# Altium schematic sheet sb-sonata-usbphy.SchDoc: USB Phy
size Letter; Organization: NewAE Technology Inc.; Address1: 1083 Queen St., Suite 196; Address2: Halifax; Address3: NS; Address4: Canada B3H 0B2; SheetNumber: 18; SheetTotal: 20; SheetApproved: NO
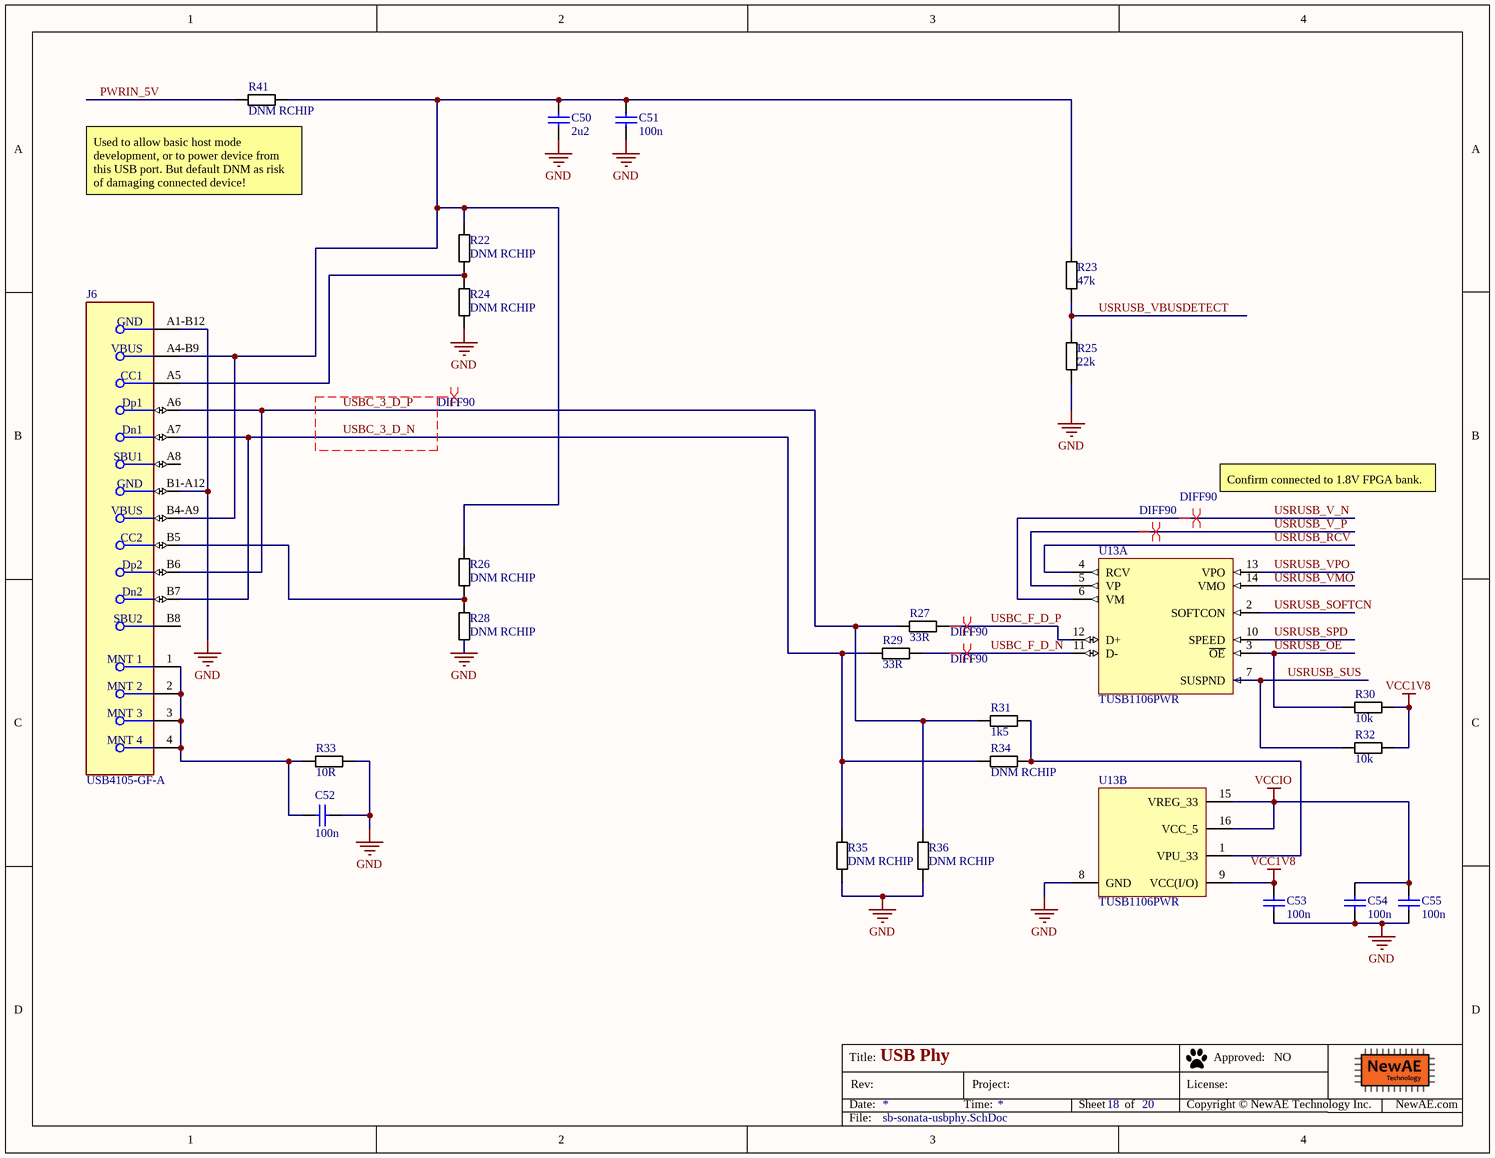
[diagram p0: sb-sonata-usbphy.SchDoc]

## Parts
C50  2u2  [CAPC0603_M]
C51  100n  [CAPC0402_M]
C52  100n  [CAPC0603_M]
C53  100n  [CAPC0402_M]
C54  100n  [CAPC0402_M]
C55  100n  [CAPC0402_M]
J6  USB4105-GF-A  [FP-USB4105-GF-A-MFG]
R22  DNM RCHIP  [RESC1608X55N]
R23  47k  [RESC1005X40N]
R24  DNM RCHIP  [RESC1608X55N]
R25  22k  [RESC1005X40N]
R26  DNM RCHIP  [RESC1608X55N]
R27  33R  [RESC1608X55N]
R28  DNM RCHIP  [RESC1608X55N]
R29  33R  [RESC1608X55N]
R30  10k  [RESC1005X40N]
R31  1k5  [RESC1608X55N]
R32  10k  [RESC1005X40N]
R33  10R  [RESC1608X55N]
R34  DNM RCHIP  [RESC1608X55N]
R35  DNM RCHIP  [RESC1608X55N]
R36  DNM RCHIP  [RESC1608X55N]
R41  DNM RCHIP  [RESC1608X55N]
U13  TUSB1106PWR  [PW0016A_L]  (parts A,B of 2)

## Nets
GND: C50.2 C51.2 C52.2 C53.2 C54.2 C55.2 J6.A1-B12(GND) J6.B1-A12(GND) R24.2 R25.2 R28.2 R33.2 R35.1 R36.1 U13.8(GND)
VCC1V8: C53.1 R30.2 R32.2 U13.9(VCC(I/O))
VCCIO: C54.1 C55.1 U13.15(VREG_33) U13.16(VCC_5)
PWRIN_5V: R41.2
USBC_3_D_N: J6.A7(Dn1) J6.B7(Dn2) R29.1 R34.1 R35.2
USBC_3_D_P: J6.A6(Dp1) J6.B6(Dp2) R27.1 R31.1 R36.2
USBC_F_D_N: R29.2 U13.11(D-)
USBC_F_D_P: R27.2 U13.12(D+)
USRUSB_OE: R30.1 U13.3(~{OE})
USRUSB_RCV: U13.4(RCV)
USRUSB_SOFTCN: U13.2(SOFTCON)
USRUSB_SPD: U13.10(SPEED)
USRUSB_SUS: R32.1 U13.7(SUSPND)
USRUSB_V_N: U13.6(VM)
USRUSB_V_P: U13.5(VP)
USRUSB_VBUSDETECT: R23.2 R25.1
USRUSB_VMO: U13.14(VMO)
USRUSB_VPO: U13.13(VPO)
NetC50_1: C50.1 C51.1 J6.A4-B9(VBUS) J6.B4-A9(VBUS) R22.1 R23.1 R26.1 R41.1
NetC52_1: C52.1 J6.1(MNT_1) J6.2(MNT_2) J6.3(MNT_3) J6.4(MNT_4) R33.1
NetJ6_A5: J6.A5(CC1) R22.2 R24.1
NetJ6_B5: J6.B5(CC2) R26.2 R28.1
NetR31_2: R31.2 R34.2 U13.1(VPU_33)

Not connected (* = marked no-connect by the designer): J6 A8(SBU1) B8(SBU2)

## Layout directives
differential pair; differential pair class DIFF90: USBC_3_D_N, USBC_3_D_P, USBC_F_D_N, USBC_F_D_P, USRUSB_V_N, USRUSB_V_P

## Notes on the sheet
- (near R41) Used to allow basic host mode development, or to power device from this USB port. But default DNM as risk of damaging connected device!
- Confirm connected to 1.8V FPGA bank.
- Title:
- Date:
- Rev:
- Time:
- Project:
- Sheet
- of
- License:
- Copyright © NewAE Technology Inc.
- Approved:
- NewAE.com
- File:

## Library data of the parts
C50 = CCHIP-2u2-0603: 2u2, 0603; Manufacture 1: Samsung; Manufacture Part Number 1: CL10B225KP8NNNC; Component Group: Capacitor; Case-EIA: 0603; Case-Metric: 1608; Rated Voltage: 10VDC; Part Number: CCHIP-2u2-0603; Footprint: 0603; Pin Count: 2; Supplier 1: Digi-Key; Supplier Part Number 1: 1276-1134-1-ND; Value: 2u2; Mounting Technology: SMT; Component Kind: Standard; Component Type: Standard
C51 C53-C55 = CCHIP-100n-0402: 100n, 0402; Manufacture Part Number 1: CGA2B3X7R1V104K050BB; Component Group: Capacitor; Case-EIA: 0402; Part Number: CCHIP-100n-0402; Footprint: 0402; Pin Count: 2; Value: 100n; Mounting Technology: SMT; Component Kind: Standard; Component Type: Standard; Supplier 1: Digi-Key; Supplier Part Number 1: 445-6901-1-ND
C52 = CCHIP-100n-0603: 100n, 0603; Manufacture 1: Kemet; Manufacture Part Number 1: C0603C104K5RACTU; Component Group: Capacitor; Case-EIA: 0603; Case-Metric: 1608; Rated Voltage: 50VDC; Part Number: CCHIP-100n-0603; Footprint: 0603; Pin Count: 2; Supplier 1: Digi-Key; Supplier Part Number 1: 399-5089-2-ND; Value: 100n; Mounting Technology: SMT; Component Kind: Standard; Component Type: Standard
J6 = CMP-245163-000001-1: CONN RCPT USB2.0 TYPEC 5A; Manufacturer: GCT; Voltage Rating: 20V; Is Female: yes; Current Rating: 5/6.25/1.25/0.25A; Number Of Contacts: 16; Conn Orientation: Right Angle; Device Class L1: Connectors; Category: Conn; Lead Free: Yes; RoHS: TRUE; Temperature Range High: +85°C; Digikey Description: CONN RCPT USB2.0 TYPEC 5A; Device Class L3: unset; ComponentLink2Description: Datasheet; Manufacturer Part Number: USB4105-GF-A; Package: 0; Usb Standard: USB 2.0; Device Class L2: USB Connectors; Automotive: No; Temperature Range Low: -40°C; Height: 3.46mm; Temperature: -40°C to +85°C; Contact Material: Gold,Nickel; ComponentLink2URL: https://gct.co/files/drawings/usb4105.pdf; Octopart: https://octopart.com/usb4105-gf-a-gct-106627878
R22 R24 R26 R28 R34-R36 R41 = RCHIP-DNM-0603: Do Not Mount Resistor; Case-EIA: 0603; Case-Metric: 1608; Part Number: RCHIP-DNM-0603; Component Group: Resistor; Footprint: 0603; Pin Count: 2; Mounting Technology: SMT; Component Kind: Standard; Component Type: Standard
R23 = RCHIP-47K-0402: 47k res, 0402, 1%, 1/16W; Manufacture 1: Yageo; Manufacture Part Number 1: RC0402FR-0747KL; Component Group: Resistor; Case-EIA: 0402; Case-Metric: 1005; Rated Power: 0.063W; Rated Voltage: 75VDC; Part Number: RCHIP-47K-0402; Footprint: 0402; Pin Count: 2; Supplier 1: Digi-Key; Supplier Part Number 1: 311-47.0KLRCT-ND; Value: 47k; Tolerance: 1%; Mounting Technology: SMT; Temperature Range: -55C to 155C; Component Kind: Standard; Component Type: Standard
R25 = RCHIP-22K-0402: 22k res, 0402, 1%, 1/16W; Manufacture 1: Yageo; Manufacture Part Number 1: RC0402FR-0722KL; Component Group: Resistor; Case-EIA: 0402; Case-Metric: 1005; Rated Power: 0.063W; Rated Voltage: 75VDC; Part Number: RCHIP-22K-0402; Footprint: 0402; Pin Count: 2; Supplier 1: Digi-Key; Supplier Part Number 1: 311-22.0KLRCT-ND; Value: 22k; Tolerance: 1%; Mounting Technology: SMT; Temperature Range: -55C to 155C; Component Kind: Standard; Component Type: Standard
R27 R29 = RCHIP-33R-0603: 33R res, 0603, 1%, 1/10W; Manufacture 1: Yageo; Manufacture Part Number 1: RC0603FR-0733RL; Component Group: Resistor; Case-EIA: 0603; Case-Metric: 1608; Rated Power: 0.1W; Rated Voltage: 75VDC; Part Number: RCHIP-33R-0603; Footprint: 0603; Pin Count: 2; Supplier 1: Digi-Key; Supplier Part Number 1: 311-33.0HRCT-ND; Value: 33R; Tolerance: 1%; Mounting Technology: SMT; Temperature Range: -55C to 155C; Component Kind: Standard; Component Type: Standard
R30 R32 = RCHIP-10K-0402: 10k res, 0402, 1%, 1/16W; Manufacture 1: Yageo; Manufacture Part Number 1: RC0402FR-0710KL; Component Group: Resistor; Case-EIA: 0402; Case-Metric: 1005; Rated Power: 0.063W; Rated Voltage: 75VDC; Part Number: RCHIP-10K-0402; Footprint: 0402; Pin Count: 2; Supplier 1: Digi-Key; Supplier Part Number 1: 311-10.0KLRCT-ND; Value: 10k; Tolerance: 1%; Mounting Technology: SMT; Temperature Range: -55C to 155C; Component Kind: Standard; Component Type: Standard
R31 = RCHIP-1K5-0603: 1k5 res, 0603, 1%, 1/10W; Manufacture 1: Yageo; Manufacture Part Number 1: RC0603FR-071K5L; Component Group: Resistor; Case-EIA: 0603; Case-Metric: 1608; Rated Power: 0.1W; Rated Voltage: 75VDC; Part Number: RCHIP-1K5-0603; Footprint: 0603; Pin Count: 2; Supplier 1: Digi-Key; Supplier Part Number 1: 311-1.50KHRCT-ND; Value: 1k5; Tolerance: 1%; Mounting Technology: SMT; Temperature Range: -55C to 155C; Component Kind: Standard; Component Type: Standard
R33 = RCHIP-10R-0603: 10R res, 0603, 1%, 1/10W; Manufacture 1: Yageo; Manufacture Part Number 1: RC0603FR-0710RL; Component Group: Resistor; Case-EIA: 0603; Case-Metric: 1608; Rated Power: 0.1W; Rated Voltage: 75VDC; Part Number: RCHIP-10R-0603; Footprint: 0603; Pin Count: 2; Supplier 1: Digi-Key; Supplier Part Number 1: 311-10.0HRCT-ND; Value: 10R; Tolerance: 1%; Mounting Technology: SMT; Temperature Range: -55C to 155C; Component Kind: Standard; Component Type: Standard
U13 = CMP-0309-00090-2: Advanced USB Transciever, Full Speed, Differential, +/-15 KV, -40 to 85 degC, 16-Pin TSSOP (PW), Green (RoHS & no Sb/Br); Manufacturer: Texas Instruments; SubFamily: USB Transceiver; Eco-Plan: Green (RoHS & no Sb/Br); Mounting Technology: Surface Mount; USB Speed: Full; ComponentLink2URL: http://www.ti.com/lit/ml/mpds361/mpds361.pdf; PackageDescription: 16-Pin Plastic Thin Small Outline Package 5 x 4.4 mm Body ,0.65 mm Pitch; ComponentLink1URL: http://www.ti.com/general/docs/lit/getliterature.tsp?genericPartNumber=TUSB1106&fileType=pdf; DatasheetVersion: SCAS818E; PartNumber: TUSB1106PWR; PackageVersion: revG, Feb-2011; PackageReference: PW0016A; ComponentLink2Description: Package Specification; ESD HBM(kV): +/-15; Code_JEDEC: MO-153; ComponentLink1Description: Datasheet